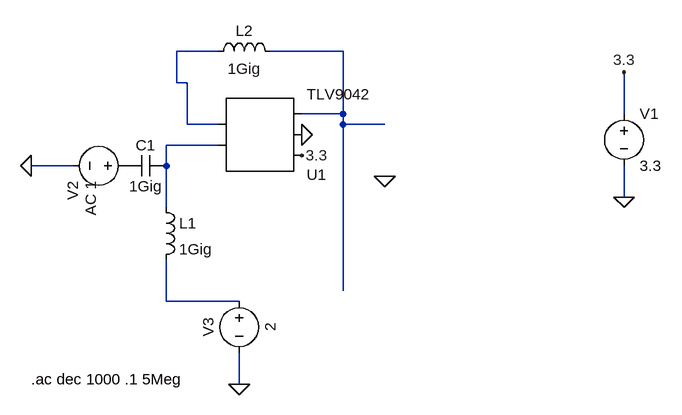
[diagram p0: schematic TLV9042_AC.asc]
TLV9042_AC.asc, the LTspice schematic file:
Version 4
SHEET 1 912 680
WIRE 224 -64 160 -64
WIRE 416 -64 304 -64
WIRE 160 -16 160 -64
WIRE 176 -16 160 -16
WIRE 416 32 416 -64
WIRE 416 32 352 32
WIRE 848 32 848 -32
WIRE 176 48 176 -16
WIRE 224 48 176 48
WIRE 416 48 416 32
WIRE 480 48 416 48
WIRE 224 80 144 80
WIRE 0 112 -64 112
WIRE 144 112 144 80
WIRE 848 160 848 112
WIRE 144 176 144 112
WIRE 416 304 416 48
WIRE 144 320 144 256
WIRE 256 320 144 320
WIRE 256 448 256 400
FLAG 352 96 3.3
FLAG 352 64 0
FLAG -64 112 0
FLAG 256 448 0
FLAG 848 160 0
FLAG 848 -32 3.3
FLAG 480 128 0
SYMBOL AutoGenerated\\TLV9042 288 64 M180
SYMATTR InstName U1
SYMBOL ind 128 160 R0
SYMATTR InstName L1
SYMATTR Value 1Gig
SYMBOL cap 144 96 R90
WINDOW 0 0 32 VBottom 2
WINDOW 3 32 32 VTop 2
SYMATTR InstName C1
SYMATTR Value 1Gig
SYMBOL voltage 96 112 R90
WINDOW 0 24 96 Left 2
WINDOW 3 24 16 Left 2
WINDOW 123 24 68 Left 2
WINDOW 39 0 0 Left 0
SYMATTR InstName V2
SYMATTR Value ""
SYMATTR Value2 AC 1
SYMBOL voltage 256 304 R0
WINDOW 0 -32 56 VBottom 2
WINDOW 3 32 56 VTop 2
WINDOW 123 0 0 Left 0
WINDOW 39 0 0 Left 0
SYMATTR InstName V3
SYMATTR Value 2
SYMBOL ind 208 -48 R270
WINDOW 0 32 56 VTop 2
WINDOW 3 5 56 VBottom 2
SYMATTR InstName L2
SYMATTR Value 1Gig
SYMBOL voltage 848 16 R0
WINDOW 123 0 0 Left 0
WINDOW 39 0 0 Left 0
SYMATTR InstName V1
SYMATTR Value 3.3
TEXT -64 440 Left 2 !.ac dec 1000 .1 5Meg

The netlist it stands for:
* TLV9042_AC.asc
* U1: TLV9042 (symbol AutoGenerated\TLV9042 not available, pins judged from their places): pin1=N003 pin2=N001 pin3=3.3 pin4=0 pin5=N002
L1 N003 N004 1Gig
C1 N003 P001 1Gig
V2 P001 0 AC 1
V3 N004 0 2
L2 N001 N002 1Gig
V1 3.3 0 3.3
.ac dec 1000 .1 5Meg
.backanno
.end